# Altium schematic sheet switch.SchDoc
size A; SheetNumber: 12; SheetTotal: 13
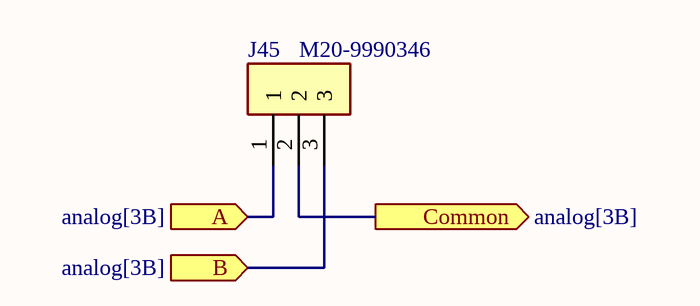
[diagram p0: switch.SchDoc]

## Parts
J45  M20-9990346  [HDRV3W64P0X254_1X3_762X254X864P]

## Ports
A (in, see analog[3B]), B (in, see analog[3B]), Common (out, see analog[3B])

## Nets
A: J45.1 ; port A
B: J45.3 ; port B
Common: J45.2 ; port Common

## Library data of the parts
J45 = M20-9990346: Connector; Manufacturer_Name: Harwin; Datasheet Link: https://cdn.harwin.com/pdfs/M20-999.pdf; Height: 8.64mm; Manufacturer_Part_Number: M20-9990346; Mouser Part Number: 855-M20-9990346; Mouser Price/Stock: https://www.mouser.co.uk/ProductDetail/Harwin/M20-9990346?qs=ulE8k0yEMYbyhQ3uXpFs8Q%3D%3D